# Altium project H2_expansion.PrjPcb
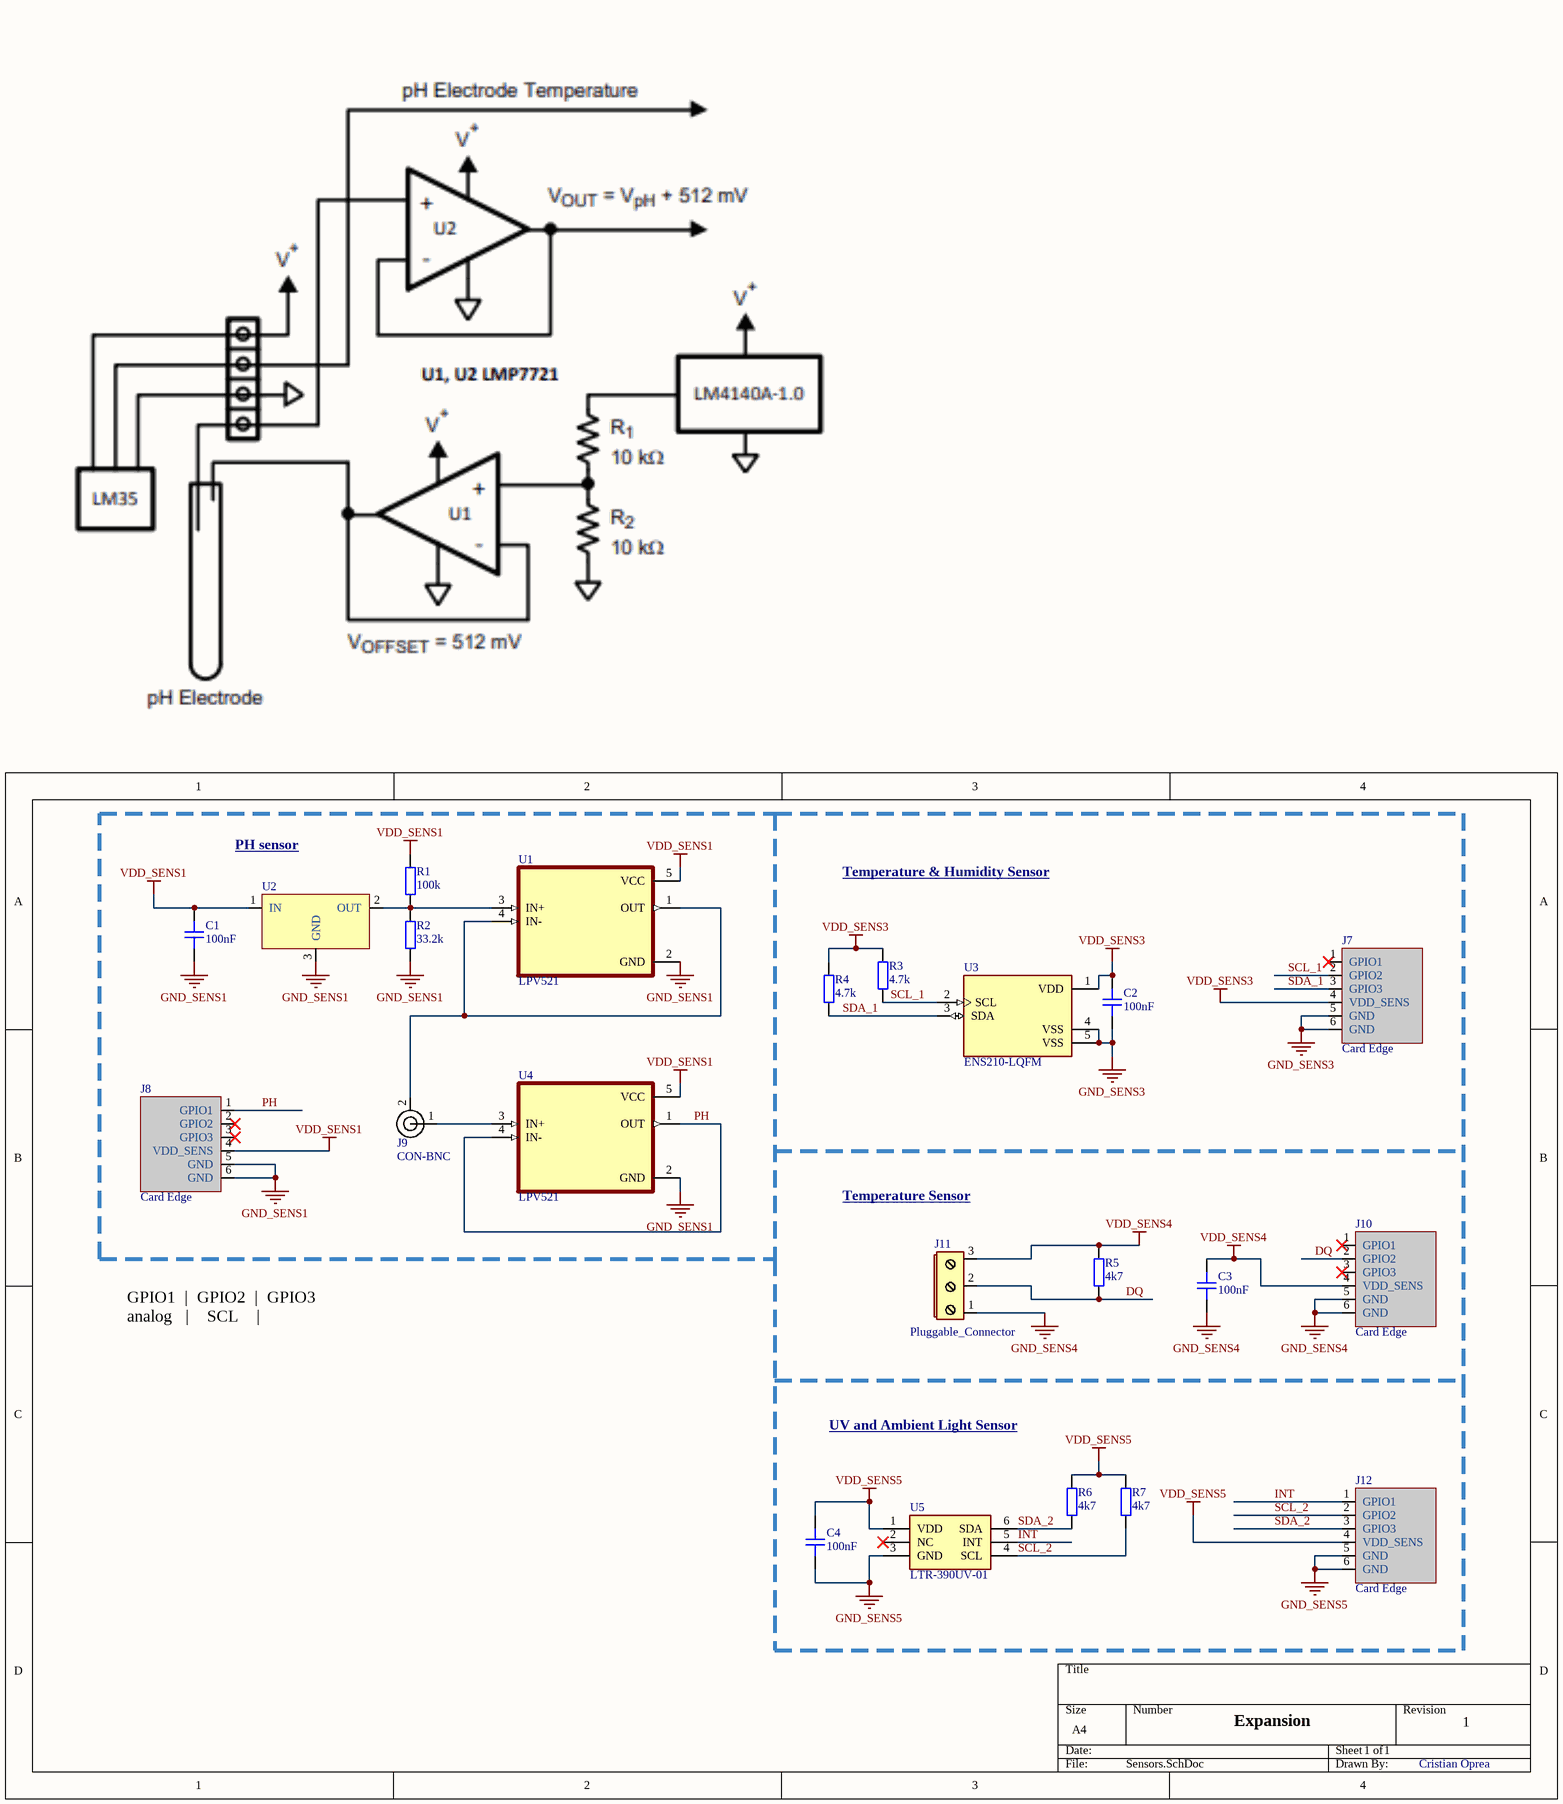
[diagram p0: Sensors.SchDoc]
2 sheets, 34 parts. Net scope: global (net labels, ports and power ports of the same name join across sheets).
Board file: PCB2.PcbDoc
Sheets:
  Sensors.SchDoc
  Blank.SchDoc

## Sheet Sensors.SchDoc
size A4; SheetNumber: 1; SheetTotal: 2

### Parts
C1  100nF  [C0603]
C2  100nF  [C0603]
C3  100nF  [C0603]
C4  100nF  [C0603]
J7  Card Edge  [Card Edge]
J8  Card Edge  [Card Edge]
J9  CON-BNC  [CON_BNC_MOLEX_0731375003]
J10  Card Edge  [Card Edge]
J11  Pluggable_Connector  [5mm_screw_terminal_3_pos]
J12  Card Edge  [Card Edge]
R1  100k  [R0603]
R2  33.2k  [R0603]
R3  4.7k  [R0603]
R4  4.7k  [R0603]
R5  4k7  [R0603]
R6  4k7  [R0603]
R7  4k7  [R0603]
U1  LPV521  [SOT65P210X110-5N]
U2  ADR5040BKSZ-REEL7  [SOT23-3]  (value not drawn)
U3  ENS210-LQFM  [XDCR_ENS210-LQFM]
U4  LPV521  [SOT65P210X110-5N]
U5  LTR-390UV-01  [LTR390-UV]

### Nets
GND_SENS1: C1.1 J8.5(GND) J8.6(GND) R2.1 U1.2(GND) U2.3(GND) U4.2(GND)
GND_SENS3: C2.1 J7.5(GND) J7.6(GND) U3.4(VSS) U3.5(VSS)
GND_SENS4: C3.1 J10.5(GND) J10.6(GND) J11.1
GND_SENS5: C4.1 J12.5(GND) J12.6(GND) U5.3(GND)
VDD_SENS1: C1.2 J8.4(VDD_SENS) R1.2 U1.5(VCC) U2.1(IN) U4.5(VCC)
VDD_SENS3: C2.2 J7.4(VDD_SENS) R3.2 R4.1 U3.1(VDD)
VDD_SENS4: C3.2 J10.4(VDD_SENS) J11.3 R5.2
VDD_SENS5: C4.2 J12.4(VDD_SENS) R6.2 R7.2 U5.1(VDD)
DQ: J10.2(GPIO2) J11.2 R5.1
INT: J12.1(GPIO1) U5.5(INT)
PH: J8.1(GPIO1) U4.1(OUT) U4.4(IN-)
SCL_1: J7.2(GPIO2) R3.1 U3.2(SCL)
SCL_2: J12.2(GPIO2) R7.1 U5.4(SCL)
SDA_1: J7.3(GPIO3) R4.2 U3.3(SDA)
SDA_2: J12.3(GPIO3) R6.1 U5.6(SDA)
NetJ9_1: J9.1 U4.3(IN+)
NetJ9_2: J9.2 U1.1(OUT) U1.4(IN-)
NetR1_1: R1.1 R2.2 U1.3(IN+) U2.2(OUT)

Not connected (* = marked no-connect by the designer): J7 1(GPIO1)*; J8 2(GPIO2)* 3(GPIO3)*; J10 1(GPIO1)* 3(GPIO3)*; U5 2(NC)*

### Notes on the sheet
- PH sensor
- Temperature & Humidity Sensor
- Temperature Sensor
- GPIO1  |  GPIO2  |  GPIO3    analog   |    SCL    |     SDA
- UV and Ambient Light Sensor
- Expansion
- 1
- Cristian Oprea

### Library data of the parts
C1-C4 = CAP_0603: Capacitor SMD 0603; Manufacturer: *; Manufacturer Part Number: *; Distributor Link: *; LCSC: *; Rating: *; Dielectric: *
J7 J8 J10 J12 = Card Edge: Card Edge pads for 2.54 mm pitch edge connector
J9 = CON-BNC: RF Connector BNC Female 50 Ohms PCB TH Mount; Manufacturer: RF Solutions; Manufacturer Part Number: CON-SMA-EDGE-S
J11 = Pluggable_Connector: Screw terminal or plug terminal
R1-R4 = RES_0603: Resistor SMD 0603; Manufacturer: *; Manufacturer Part Number: *; Distributor Link: *; LCSC: *
R5-R7 = RES_0805: Resistor SMD 0805; Manufacturer: *; Manufacturer Part Number: *; Distributor Link: *; LCSC: *
U1 U4 = LPV521: MP: MAX4466EXK; Package: None; Price: None; Value: *; Availability: Unavailable
U2 = VREF: Voltage References 2.048 Low-Cost, Micropower, Low-Dropout, High-Output-Current, SOT23; Manufacturer: Maxim Integrated; Manufacturer Part Number: MAX6101EUR+T
U3 = ENS210-LQFM: Humidity/Temperature Sensor Digital Serial (2-Wire, I2C) 4-Pin QFN EP T/R; MF: ScioSense; SnapEDA_Link: https://www.snapeda.com/parts/ENS210-LQFM/ScioSense/view-part/?ref=snap; Package: NON STANDARD-5 ScioSense; Value: *; MP: ENS210-LQFM; Check_prices: https://www.snapeda.com/parts/ENS210-LQFM/ScioSense/view-part/?ref=eda
U5 = LTR-390UV-01: SENSOR OPT ULTRAVIOLET 6PINS; Manufacturer_Name: Lite-On; Geometry.Height: 0.9mm; Manufacturer_Part_Number: LTR-390UV-01; Mouser Part Number: 859-LTR390UV01; Mouser Price/Stock: https://www.mouser.co.uk/ProductDetail/Lite-On/LTR-390UV-01?qs=g5ciJ0jwZaECcUd5i6p7%252Bg%3D%3D; Arrow Part Number: LTR-390UV-01; Arrow Price/Stock: https://www.arrow.com/en/products/ltr-390uv-01/lite-on-technology?region=nac; Datasheet Link: https://www.arrow.com/en/products/ltr-390uv-01/lite-on-technology

## Sheet Blank.SchDoc
size A4; SheetNumber: 2; SheetTotal: 2
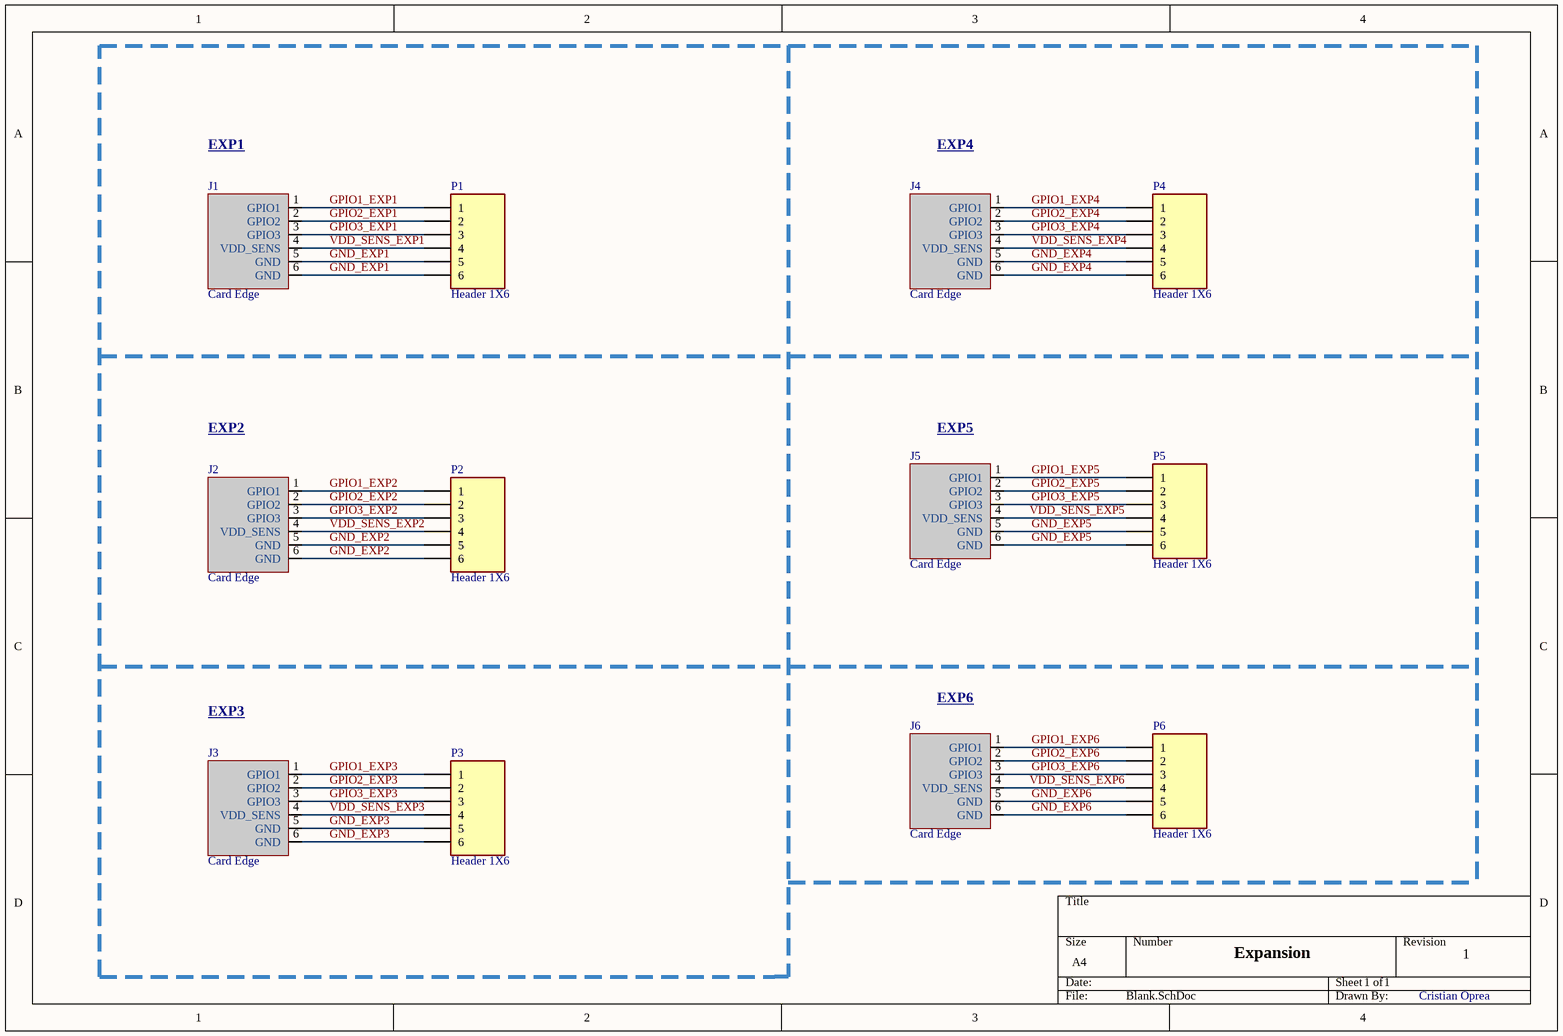
[diagram p1: Blank.SchDoc]

### Parts
J1  Card Edge  [Card Edge]
J2  Card Edge  [Card Edge]
J3  Card Edge  [Card Edge]
J4  Card Edge  [Card Edge]
J5  Card Edge  [Card Edge]
J6  Card Edge  [Card Edge]
P1  Header 1X6  [HEADER_1x6_2.54]
P2  Header 1X6  [HEADER_1x6_2.54]
P3  Header 1X6  [HEADER_1x6_2.54]
P4  Header 1X6  [HEADER_1x6_2.54]
P5  Header 1X6  [HEADER_1x6_2.54]
P6  Header 1X6  [HEADER_1x6_2.54]

### Nets
GND_EXP1: J1.5(GND) J1.6(GND) P1.5 P1.6
GND_EXP2: J2.5(GND) J2.6(GND) P2.5 P2.6
GND_EXP3: J3.5(GND) J3.6(GND) P3.5 P3.6
GND_EXP4: J4.5(GND) J4.6(GND) P4.5 P4.6
GND_EXP5: J5.5(GND) J5.6(GND) P5.5 P5.6
GND_EXP6: J6.5(GND) J6.6(GND) P6.5 P6.6
GPIO1_EXP1: J1.1(GPIO1) P1.1
GPIO1_EXP2: J2.1(GPIO1) P2.1
GPIO1_EXP3: J3.1(GPIO1) P3.1
GPIO1_EXP4: J4.1(GPIO1) P4.1
GPIO1_EXP5: J5.1(GPIO1) P5.1
GPIO1_EXP6: J6.1(GPIO1) P6.1
GPIO2_EXP1: J1.2(GPIO2) P1.2
GPIO2_EXP2: J2.2(GPIO2) P2.2
GPIO2_EXP3: J3.2(GPIO2) P3.2
GPIO2_EXP4: J4.2(GPIO2) P4.2
GPIO2_EXP5: J5.2(GPIO2) P5.2
GPIO2_EXP6: J6.2(GPIO2) P6.2
GPIO3_EXP1: J1.3(GPIO3) P1.3
GPIO3_EXP2: J2.3(GPIO3) P2.3
GPIO3_EXP3: J3.3(GPIO3) P3.3
GPIO3_EXP4: J4.3(GPIO3) P4.3
GPIO3_EXP5: J5.3(GPIO3) P5.3
GPIO3_EXP6: J6.3(GPIO3) P6.3
VDD_SENS_EXP1: J1.4(VDD_SENS) P1.4
VDD_SENS_EXP2: J2.4(VDD_SENS) P2.4
VDD_SENS_EXP3: J3.4(VDD_SENS) P3.4
VDD_SENS_EXP4: J4.4(VDD_SENS) P4.4
VDD_SENS_EXP5: J5.4(VDD_SENS) P5.4
VDD_SENS_EXP6: J6.4(VDD_SENS) P6.4

### Notes on the sheet
- EXP1
- EXP4
- EXP2
- (near J5) EXP5
- EXP3
- (near J6) EXP6
- Expansion
- 1
- Cristian Oprea

### Library data of the parts
J1-J6 = Card Edge: as J7 on sheet Sensors
P1-P6 = Header 1X6: Header,6-Pin, Single row; LatestRevisionDate: 17-Jul-2002; LatestRevisionNote: Re-released for DXP Platform.; Publisher: Altium Limited